# Altium schematic sheet Camera-Connectors.SchDoc: External Camera connector
size A4; Date: 25-FEB-2015; Author: A.B; CompanyName: STMicroelectronics; Address1: 12, Rue Jules HOROWITZ; Address2: 38019 Grenoble; Address3: FRANCE; DocumentNumber: MB1191; Revision: B-02; SheetNumber: 13; SheetTotal: 14; Project: STM32F746G-DISCO
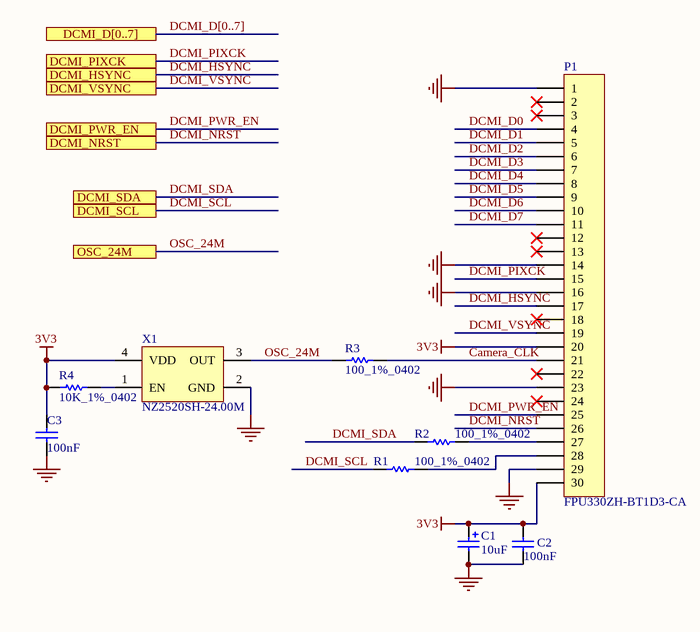
[diagram p0: Camera-Connectors.SchDoc]

## Parts
C1  10uF  [TAN-A]
C2  100nF  [0402C]
C3  100nF  [0402C]
P1  FPU330ZH-BT1D3-CA  [FPU330ZH-BT1D3-CA]
R1  100_1%_0402  [0402R]
R2  100_1%_0402  [0402R]
R3  100_1%_0402  [0402R]
R4  10K_1%_0402  [0402R]
X1  NZ2520SH-24.00M  [NZ2520SH_4P]

## Ports
DCMI_D[0..7], DCMI_HSYNC, DCMI_NRST, DCMI_PIXCK, DCMI_PWR_EN, DCMI_SCL, DCMI_SDA, DCMI_VSYNC, OSC_24M

## Nets
3V3: C1.1 C2.2 C3.2 P1.20 P1.30 R4.1 X1.4(VDD)
GND: C1.2 C2.1 C3.1 P1.1 P1.14 P1.16 P1.23 P1.29 X1.2(GND)
Camera_CLK: P1.21 R3.2
DCMI_D0: P1.4
DCMI_D1: P1.5
DCMI_D2: P1.6
DCMI_D3: P1.7
DCMI_D4: P1.8
DCMI_D5: P1.9
DCMI_D6: P1.10
DCMI_D7: P1.11
DCMI_HSYNC: P1.17 ; port DCMI_HSYNC
DCMI_NRST: P1.26 ; port DCMI_NRST
DCMI_PIXCK: P1.15 ; port DCMI_PIXCK
DCMI_PWR_EN: P1.25 ; port DCMI_PWR_EN
DCMI_SCL: R1.1 ; port DCMI_SCL
DCMI_SDA: R2.1 ; port DCMI_SDA
DCMI_VSYNC: P1.19 ; port DCMI_VSYNC
OSC_24M: R3.1 X1.3(OUT) ; port OSC_24M
NetP1_27: P1.27 R2.2
NetP1_28: P1.28 R1.2
NetR4_2: R4.2 X1.1(EN)

Not connected (* = marked no-connect by the designer): P1 2* 3* 12* 13* 18* 22* 24*

## Buses and harness runs
bus DCMI_D[0..7] = port DCMI_D[0..7]

## Notes on the sheet
- Title:
- Project:
- Size:
- Revision:
- Variant:
- A4
- -
- Date:
- Reference:
- Sheet:
- of

## Library data of the parts
C1 = Cap_10uF_POL_10%_TANA: Polarized Capacitor,10uF,10V,10%,typeA,VISHAY; Manuf_Part_1: 293D106X9010A2TE3; Revision: July-2002: Re-released for DXP Platform.; Value: 10uF; Manuf_1: VISHAY; Order: *; ECCN_US/EU: n/a
C2 C3 = Cap_100nF_X7R_10%_0402: Capacitor,100nF,16V,X7R,10%,0402,YAGEO; Manuf_Part_1: CC0402KRX7R7BB104; Revision: July-2002: Re-released for DXP Platform.; Value: 100nF; Order: CC0402KRX7R7BB104; Manuf_1: YAGEO
P1 = FPU330ZH-BT1D3-CA: TOWNES -  Connector FFC/FPC ZIF 0.5mm 30 pins, Lower Contacts; Manuf_Part_2: TFP-A330ZH-BT1-ECX; Manuf_Part_1: FPU330ZH-BT1D3-CA; Order: *; Manuf_1: TOWNES; Distrib: Sub Co; ECCN_US/EU: n/a; Manuf_2: TOWNES
R1-R3 = Res_100_1%_0402: Resistor,100,0402,1%,YAGEO; Manuf_Part_1: RC0402FR-07100RL; Value: 100; Order: 9239111; Manuf_1: YAGEO; ECCN_US/EU: n/a; Distrib: FARNELL
R4 = Res_10K_1%_0402: Resistor,10K,0402,1%,YAGEO; Manuf_Part_1: RC0402FR-0710KL; Value: 10K; Manuf_1: YAGEO; Order: RC0402FR-0710KL; ECCN_US/EU: n/a
X1 = OSC_24M_NZ2520SB: Oscillator 24.00Mhz, -+50PPM, 3.3V, Temp -55 to +125°C; Manuf_Part_1: NZ2520SH 24MHz END4869D; Manuf_1: NDK; ECCN_US/EU: EAR99/NEC; Provided: ST; Order: *